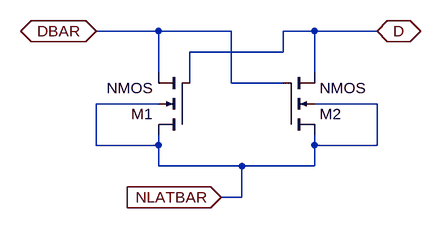
[diagram p0: schematic NSenseAmp.asc]
NSenseAmp.asc, the LTspice schematic file:
Version 4
SHEET 1 880 680
WIRE 96 64 0 64
WIRE 208 64 96 64
WIRE 336 64 288 64
WIRE 432 64 336 64
WIRE 288 96 288 64
WIRE 288 96 144 96
WIRE 96 128 96 64
WIRE 336 128 336 64
WIRE 144 144 144 96
WIRE 208 144 208 64
WIRE 288 144 208 144
WIRE 96 176 0 176
WIRE 432 176 336 176
WIRE 0 240 0 176
WIRE 96 240 96 224
WIRE 96 240 0 240
WIRE 336 240 336 224
WIRE 432 240 432 176
WIRE 432 240 336 240
WIRE 96 272 96 240
WIRE 224 272 96 272
WIRE 336 272 336 240
WIRE 336 272 224 272
WIRE 224 320 224 272
WIRE 224 320 192 320
FLAG 0 64 DBAR
IOPIN 0 64 BiDir
FLAG 432 64 D
IOPIN 432 64 BiDir
FLAG 192 320 NLATBAR
IOPIN 192 320 In
SYMBOL nmos4 144 224 R180
SYMATTR InstName M1
SYMATTR Value2 l=0.6u w=3u
SYMBOL nmos4 288 224 M180
SYMATTR InstName M2
SYMATTR Value2 l=0.6u w=3u

The netlist it stands for:
* NSenseAmp.asc
M1 NLATBAR D DBAR NLATBAR NMOS l=0.6u w=3u
M2 NLATBAR DBAR D NLATBAR NMOS l=0.6u w=3u
.model NMOS NMOS
.model PMOS PMOS
.lib standard.mos
.backanno
.end